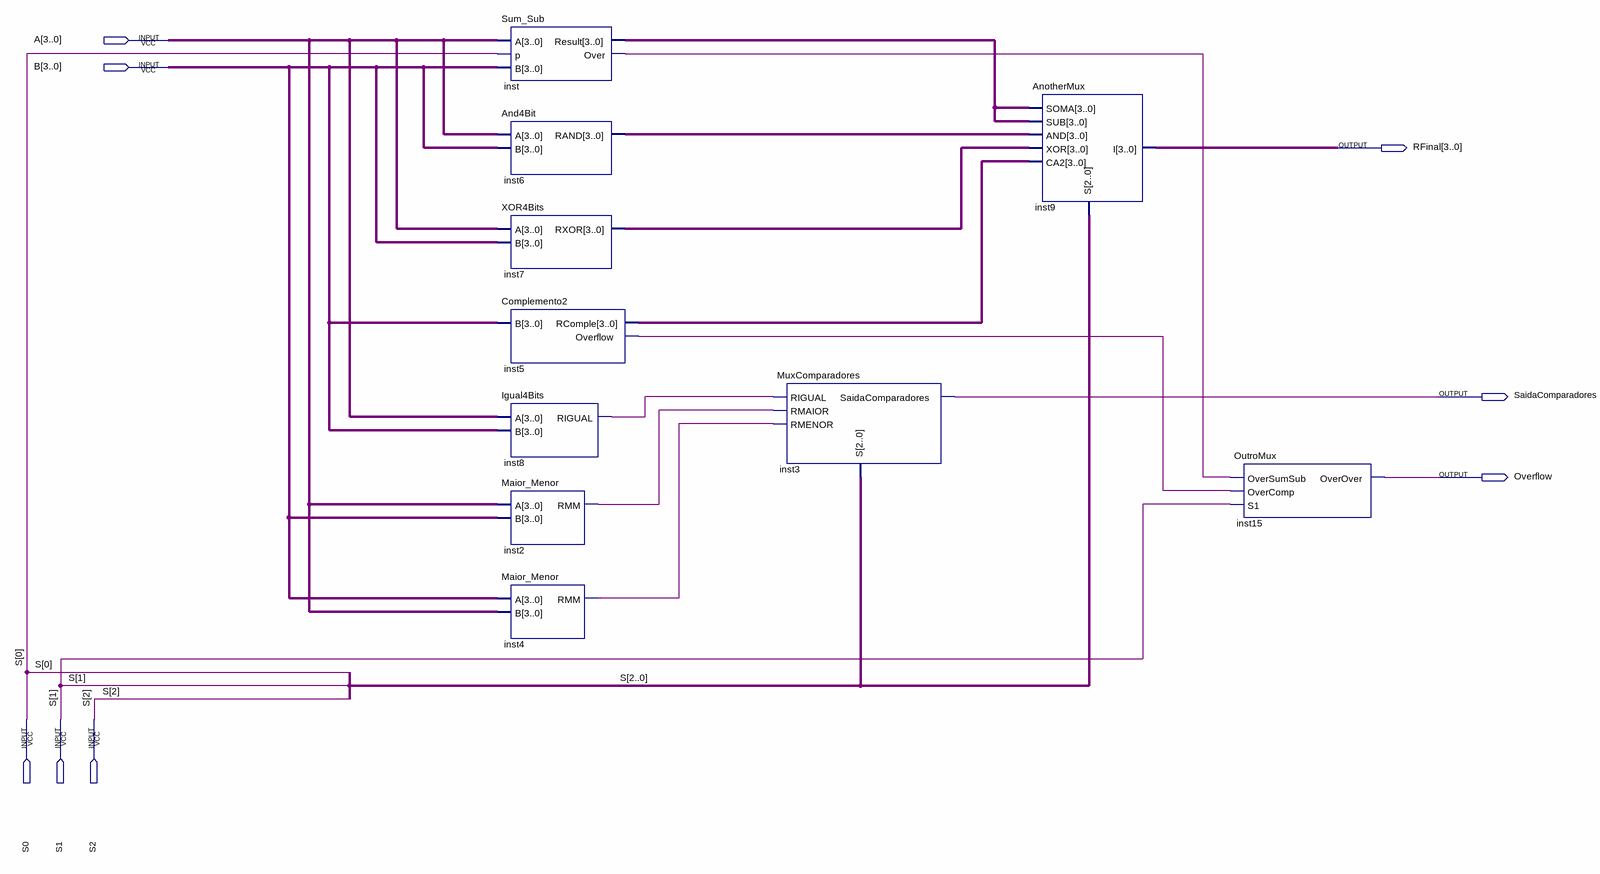
[diagram p0: schematic sheet]
// Quartus schematic ULA.bdf as structural Verilog: 10 symbols, 8 pins
module ULA (
  input  [3:0] A,
  input  [3:0] B,
  input  S0,
  input  S1,
  input  S2,
  output [3:0] RFinal,
  output SaidaComparadores,
  output Overflow
);

  wire inst2_rmm, inst4_rmm, inst5_overflow, inst8_rigual, inst_over;
  wire [3:0] inst5_rcomple, inst6_rand, inst7_rxor, inst_result;

  Sum_Sub inst (.A(A), .p(S0), .B(B), .Result(inst_result), .Over(inst_over));
  And4Bit inst6 (.A(A), .B(B), .RAND(inst6_rand));
  XOR4Bits inst7 (.A(A), .B(B), .RXOR(inst7_rxor));
  Complemento2 inst5 (.B(B), .RComple(inst5_rcomple), .Overflow(inst5_overflow));
  Igual4Bits inst8 (.A(A), .B(B), .RIGUAL(inst8_rigual));
  Maior_Menor inst2 (.A(A), .B(B), .RMM(inst2_rmm));
  Maior_Menor inst4 (.A(B), .B(A), .RMM(inst4_rmm));
  MuxComparadores inst3 (
    .RMENOR(inst4_rmm), .RMAIOR(inst2_rmm), .RIGUAL(inst8_rigual), .S({S2, S1, S0}),
    .SaidaComparadores(SaidaComparadores));
  AnotherMux inst9 (
    .SOMA(inst_result), .SUB(inst_result), .CA2(inst5_rcomple), .AND(inst6_rand), .XOR(inst7_rxor),
    .S({S2, S1, S0}), .I(RFinal));
  OutroMux inst15 (.OverSumSub(inst_over), .S1(S1), .OverComp(inst5_overflow), .OverOver(Overflow));
endmodule
